# EAGLE schematic Gain+HPF (EAGLE 7.6.0)
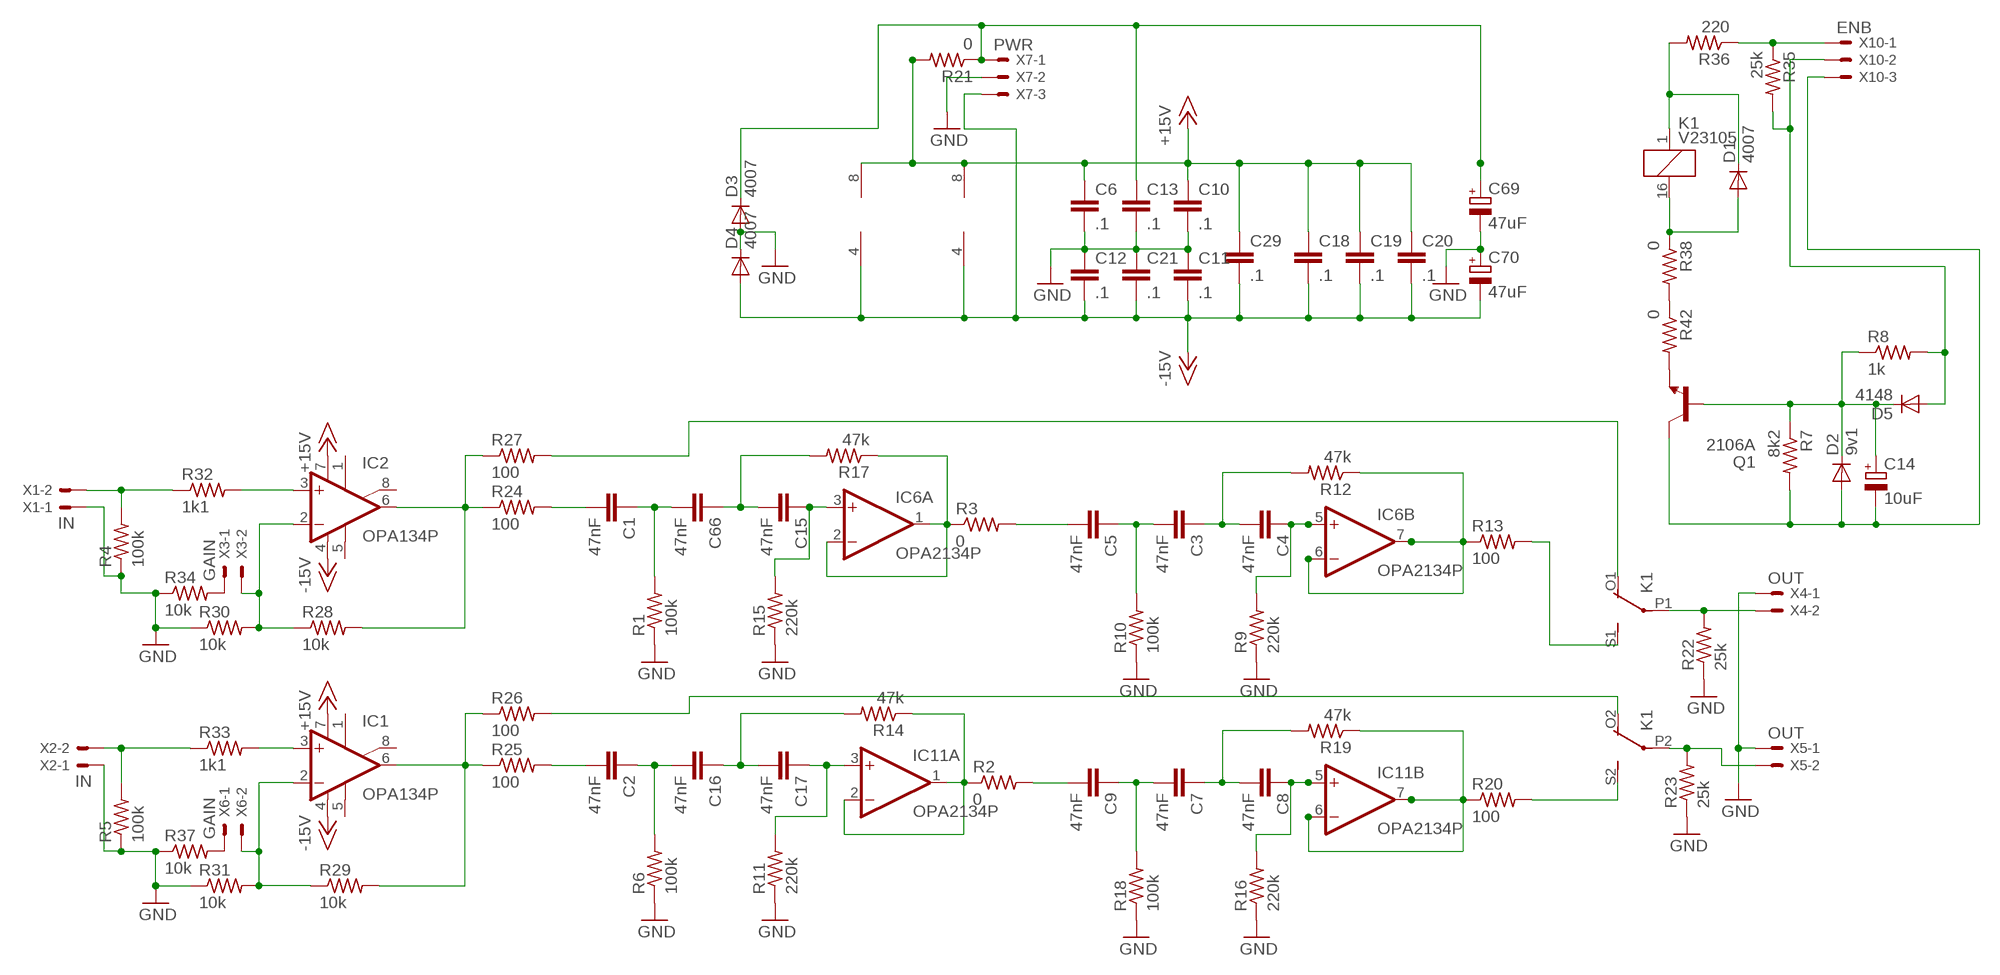
[diagram p0: schematic, sheet 1]

## Parts
C1  47nF  C-EU050-075X075  [C050-075X075]
C2  47nF  C-EU050-075X075  [C050-075X075]
C3  47nF  C-EU050-075X075  [C050-075X075]
C4  47nF  C-EU050-075X075  [C050-075X075]
C5  47nF  C-EU050-075X075  [C050-075X075]
C6  .1  C-EUC4532  [C4532]
C7  47nF  C-EU050-075X075  [C050-075X075]
C8  47nF  C-EU050-075X075  [C050-075X075]
C9  47nF  C-EU050-075X075  [C050-075X075]
C10  .1  C-EUC4532  [C4532]
C11  .1  C-EUC4532  [C4532]
C12  .1  C-EUC4532  [C4532]
C13  .1  C-EUC4532  [C4532]
C14  10uF  CPOL-EUE2.5-6  [E2,5-6]
C15  47nF  C-EU050-075X075  [C050-075X075]
C16  47nF  C-EU050-075X075  [C050-075X075]
C17  47nF  C-EU050-075X075  [C050-075X075]
C18  .1  C-EUC4532  [C4532]
C19  .1  C-EUC4532  [C4532]
C20  .1  C-EUC4532  [C4532]
C21  .1  C-EUC4532  [C4532]
C29  .1  C-EUC4532  [C4532]
C66  47nF  C-EU050-075X075  [C050-075X075]
C69  47uF  CPOL-EUE2.5-7  [E2,5-7]
C70  47uF  CPOL-EUE2.5-7  [E2,5-7]
D1  4007  1N4148DO35-7  [DO35-7]
D2  9v1  1N4148DO35-7  [DO35-7]
D3  4007  1N4148DO35-10  [DO35-10]
D4  4007  1N4148DO35-10  [DO35-10]
D5  4148  1N4148DO35-7  [DO35-7]
IC1  OPA134P  [DIL08]
IC2  OPA134P  [DIL08]
IC6  OPA2134P  [DIL08]
IC11  OPA2134P  [DIL08]
K1  V23105  351  [351]
Q1  2106A  BC546B  [TO92-EBC]
R1  100k  R-US_0309/10  [0309/10]
R2  0  R-US_0309/10  [0309/10]
R3  0  R-US_0309/12  [0309/12]
R4  100k  R-US_0309/12  [0309/12]
R5  100k  R-US_0309/12  [0309/12]
R6  100k  R-US_0309/10  [0309/10]
R7  8k2  R-US_R1210  [R1210]
R8  1k  R-US_R1210  [R1210]
R9  220k  R-US_0309/10  [0309/10]
R10  100k  R-US_0309/10  [0309/10]
R11  220k  R-US_0309/10  [0309/10]
R12  47k  R-US_0309/10  [0309/10]
R13  100  R-US_0309/10  [0309/10]
R14  47k  R-US_0309/10  [0309/10]
R15  220k  R-US_0309/10  [0309/10]
R16  220k  R-US_0309/10  [0309/10]
R17  47k  R-US_0309/10  [0309/10]
R18  100k  R-US_0309/10  [0309/10]
R19  47k  R-US_0309/10  [0309/10]
R20  100  R-US_0309/10  [0309/10]
R21  0  R-US_0309/10  [0309/10]
R22  25k  R-US_0309/10  [0309/10]
R23  25k  R-US_0309/10  [0309/10]
R24  100  R-US_0309/12  [0309/12]
R25  100  R-US_0309/12  [0309/12]
R26  100  R-US_0309/10  [0309/10]
R27  100  R-US_0309/10  [0309/10]
R28  10k  R-US_0309/10  [0309/10]
R29  10k  R-US_0309/10  [0309/10]
R30  10k  R-US_0309/10  [0309/10]
R31  10k  R-US_0309/10  [0309/10]
R32  1k1  R-US_0309/10  [0309/10]
R33  1k1  R-US_0309/10  [0309/10]
R34  10k  R-US_0309/10  [0309/10]
R35  25k  R-US_0309/10  [0309/10]
R36  220  R-US_0309/10  [0309/10]
R37  10k  R-US_0309/10  [0309/10]
R38  0  R-US_0309/10  [0309/10]
R42  0  R-US_0309/10  [0309/10]
X1  IN  22-23-2021  [22-23-2021]
X2  IN  22-23-2021  [22-23-2021]
X3  GAIN  22-23-2021  [22-23-2021]
X4  OUT  22-23-2021  [22-23-2021]
X5  OUT  22-23-2021  [22-23-2021]
X6  GAIN  22-23-2021  [22-23-2021]
X7  PWR  22-23-2031  [22-23-2031]
X10  ENB  22-23-2031  [22-23-2031]

## Nets
+15V: C6.1 C10.1 C18.1 C19.1 C20.1 C29.1 IC1.7(V+) IC2.7(V+) IC6.8(P:V+) IC11.8(P:V+) R21.2
-15V: C11.2 C12.2 C18.2 C19.2 C20.2 C21.2 C29.2 C70.- D4.A IC1.4(V-) IC2.4(V-) IC6.4(P:V-) IC11.4(P:V-) X7.3
GND: C6.2 C10.2 C11.1 C12.1 C13.2 C21.1 C69.- C70.+ D3.A D4.C R1.1 R4.1 R5.1 R6.1 R9.1 R10.1 R11.1 R15.1 R16.1 R18.1 R22.1 R23.1 R30.1 R31.1 R34.1 R37.1 X1.1 X2.1 X4.1 X5.1 X7.2
N$1: IC6.1(A:OUT) IC6.2(A:-IN) R3.1 R17.1
N$2: IC6.6(B:-IN) IC6.7(B:OUT) R12.1 R13.1
N$3: C4.1 IC6.5(B:+IN) R9.2
N$4: C3.1 C4.2 R12.2
N$6: R5.2 R33.1 X2.2
N$7: R4.2 R32.1 X1.2
N$8: C14.- D2.A Q1.C R7.2 X10.3
N$9: C3.2 C5.1 R10.2
N$10: C5.2 R3.2
N$11: IC11.6(B:-IN) IC11.7(B:OUT) R19.1 R20.1
N$12: C15.1 IC6.3(A:+IN) R15.2
N$13: C15.2 C66.1 R17.2
N$14: C8.1 IC11.5(B:+IN) R16.2
N$15: C16.1 C17.2 R14.2
N$16: C17.1 IC11.3(A:+IN) R11.2
N$17: C7.1 C8.2 R19.2
N$18: C7.2 C9.1 R18.2
N$19: IC2.6(OUT) R24.1 R27.1 R28.2
N$20: IC1.6(OUT) R25.1 R26.1 R29.2
N$21: K1.S1(2:S) R13.2
N$22: K1.S2(3:S) R20.2
N$23: C13.1 C69.+ D3.C R21.1 X7.1
N$24: K1.O1(2:O) R27.2
N$25: K1.O2(3:O) R26.2
N$26: C1.2 R24.2
N$27: C9.2 R2.2
N$28: IC11.1(A:OUT) IC11.2(A:-IN) R2.1 R14.1
N$29: C2.2 R25.2
N$30: IC2.3(+IN) R32.2
N$31: IC2.2(-IN) R28.1 R30.2 X3.2
N$32: K1.P2(3:P) R23.2 X5.2
N$33: K1.P1(2:P) R22.2 X4.2
N$34: IC1.3(+IN) R33.2
N$35: IC1.2(-IN) R29.1 R31.2 X6.2
N$36: R34.2 X3.1
N$37: R37.2 X6.1
N$38: C14.+ D2.C D5.C Q1.B R7.1 R8.1
N$39: D1.A K1.16 R38.1
N$40: D1.C K1.1 R36.2
N$44: R35.1 R36.1 X10.1
N$47: D5.A R8.2 R35.2 X10.2
N$49: Q1.E R42.2
N$50: R38.2 R42.1
N$76: C1.1 C66.2 R1.2
N$102: C2.1 C16.2 R6.2
Unconnected: IC1.1(ON1) IC1.5(OPT) IC1.8(ON2) IC2.1(ON1) IC2.5(OPT) IC2.8(ON2)

## Library data of the parts
C1-C13 C15-C21 C29 C66 = resistor:C-EU: CAPACITOR, European symbol
C14 C69 C70 = resistor:CPOL-EU: POLARIZED CAPACITOR, European symbol
D1-D5 = diode:1N4148: DIODE high speed (Philips)
IC1 IC2 = linear:OPA134: AUDIO AMPLIFIER
IC6 IC11 = linear:OPA2134: SoundPLUS (TM) High Performance AUDIO OPERATIONAL AMPLIFIERS Source: http://focus.ti.com/lit/ds/sbos058/sbos058.pdf
K1 = relay:351: RELAY 2 x switch, Omron; OC_FARNELL: unknown; OC_NEWARK: unknown
Q1 = transistor-npn:BC546*: NPN Transistor
R1-R38 R42 = resistor:R-US_: RESISTOR, American symbol
X1-X6 = con-molex:22-23-2021: .100" (2.54mm) Center Header - 2 Pin; MF: MOLEX; MPN: 22-23-2021; OC_FARNELL: 1462926; OC_NEWARK: 25C3832
X7 X10 = con-molex:22-23-2031: .100" (2.54mm) Center Header - 3 Pin; MF: MOLEX; MPN: 22-23-2031; OC_FARNELL: 1462950; OC_NEWARK: 30C0862